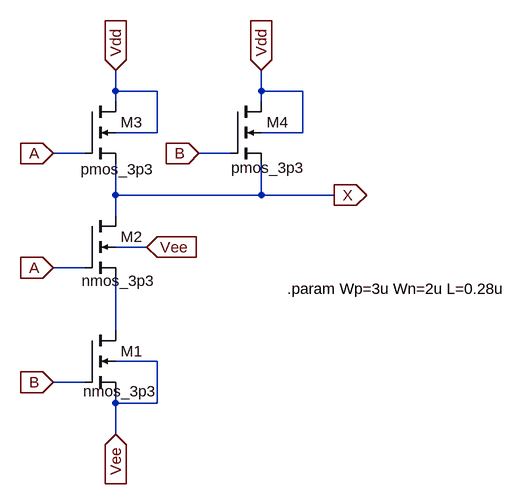
[diagram p0: schematic NAND2x1.asc]
NAND2x1.asc, the LTspice schematic file:
Version 4.1
SHEET 1 900 680
WIRE -96 32 -96 0
WIRE -32 32 -96 32
WIRE 128 32 128 0
WIRE 192 32 128 32
WIRE -96 48 -96 32
WIRE 128 48 128 32
WIRE -32 96 -32 32
WIRE -32 96 -96 96
WIRE 192 96 192 32
WIRE 192 96 128 96
WIRE -144 128 -192 128
WIRE 80 128 32 128
WIRE -96 192 -96 144
WIRE 128 192 128 144
WIRE 128 192 -96 192
WIRE 240 192 128 192
WIRE -96 224 -96 192
WIRE -48 272 -96 272
WIRE -144 304 -192 304
WIRE -96 400 -96 320
WIRE -32 448 -96 448
WIRE -144 480 -192 480
WIRE -96 512 -96 496
WIRE -32 512 -32 448
WIRE -32 512 -96 512
WIRE -96 560 -96 512
FLAG -96 0 Vdd
IOPIN -96 0 In
FLAG -192 128 A
IOPIN -192 128 In
FLAG 240 192 X
IOPIN 240 192 Out
FLAG 128 0 Vdd
IOPIN 128 0 In
FLAG -192 304 A
IOPIN -192 304 In
FLAG -192 480 B
IOPIN -192 480 In
FLAG 32 128 B
IOPIN 32 128 In
FLAG -96 560 Vee
IOPIN -96 560 In
FLAG -48 272 Vee
IOPIN -48 272 In
SYMBOL nmos4 -144 400 R0
WINDOW 3 -2 94 Left 2
SYMATTR Value nmos_3p3
SYMATTR InstName M1
SYMATTR Value2 l={L} w={Wn}
SYMBOL nmos4 -144 48 R0
WINDOW 3 -6 104 Left 2
SYMATTR Value pmos_3p3
SYMATTR InstName M3
SYMATTR Value2 l={L} w={Wp}
SYMBOL nmos4 80 48 R0
WINDOW 3 2 102 Left 2
SYMATTR Value pmos_3p3
SYMATTR InstName M4
SYMATTR Value2 l={L} w={Wp}
SYMBOL nmos4 -144 224 R0
WINDOW 3 -4 100 Left 2
SYMATTR Value nmos_3p3
SYMATTR InstName M2
SYMATTR Value2 l={L} w={Wn}
TEXT 168 336 Left 2 !.param Wp=3u Wn=2u L=0.28u

The netlist it stands for:
* NAND2x1.asc
M1 N001 B Vee Vee nmos_3p3 l={L} w={Wn}
M3 Vdd A X Vdd pmos_3p3 l={L} w={Wp}
M4 Vdd B X Vdd pmos_3p3 l={L} w={Wp}
M2 X A N001 Vee nmos_3p3 l={L} w={Wn}
.model NMOS NMOS
.model PMOS PMOS
.lib standard.mos
.param Wp=3u Wn=2u L=0.28u
.backanno
.end